# Altium project PowerDistReva.PrjPcb
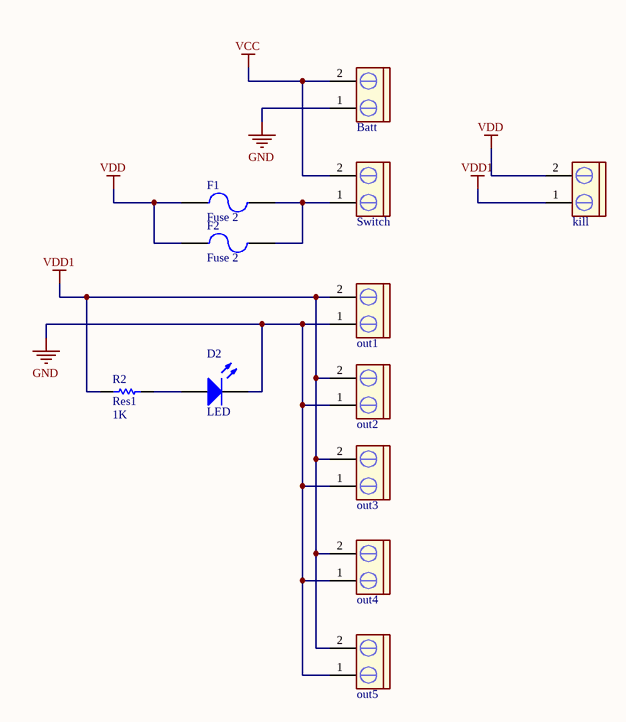
[diagram p0: PowerDistReva.SchDoc]
1 sheet, 12 parts. Net scope: global (net labels, ports and power ports of the same name join across sheets).
Board file: PowerDistReva.PcbDoc

## Sheet PowerDistReva.SchDoc
size A4

### Parts
Batt  CON2 pin blue  [My_CN2]  (value not drawn)
D2  LED  [My_LED3MM]
F1  Fuse 2  [PCBComponent_1]
F2  Fuse 2  [PCBComponent_1]
kill  CON2 pin blue  [My_CN2]  (value not drawn)
out1  CON2 pin blue  [My_CN2]  (value not drawn)
out2  CON2 pin blue  [My_CN2]  (value not drawn)
out3  CON2 pin blue  [My_CN2]  (value not drawn)
out4  CON2 pin blue  [My_CN2]  (value not drawn)
out5  CON2 pin blue  [My_CN2]  (value not drawn)
R2  Res1  value 1K  [AXIAL-0.3]
Switch  CON2 pin blue  [My_CN2]  (value not drawn)

### Nets
GND: Batt.1 D2.K out1.1 out2.1 out3.1 out4.1 out5.1
VCC: Batt.2 Switch.2
VDD: F1.1 F2.1 kill.2
VDD1: kill.1 out1.2 out2.2 out3.2 out4.2 out5.2 R2.1
NetD2_A: D2.A R2.2
NetF1_2: F1.2 F2.2 Switch.1

### Library data of the parts
Batt kill out1-out5 Switch = CON2 pin blue: Connector blue screw
D2 = LED: Typical INFRARED GaAs LED; Published: 8-Jun-2000; LatestRevisionDate: 08-Jul-2005; LatestRevisionNote: Mech Layer 1 removed.; Publisher: Altium Limited
F1 F2 = Fuse 2: Fuse; Published: 8-Jun-2000; LatestRevisionDate: 17-Jul-2002; LatestRevisionNote: Re-released for DXP Platform.; PackageReference: PIN-W2/E2.8; Publisher: Altium Limited; PackageDescription: Thru-Hole; 2 Leads
R2 = Res1: Resistor; Published: 8-Jun-2000; LatestRevisionDate: 17-Jul-2002; LatestRevisionNote: Re-released for DXP Platform.; PackageReference: AXIAL-0.3; Publisher: Altium Limited; PackageDescription: Axial Device, Thru-Hole; 2 Leads; 0.3 in Pin Spacing